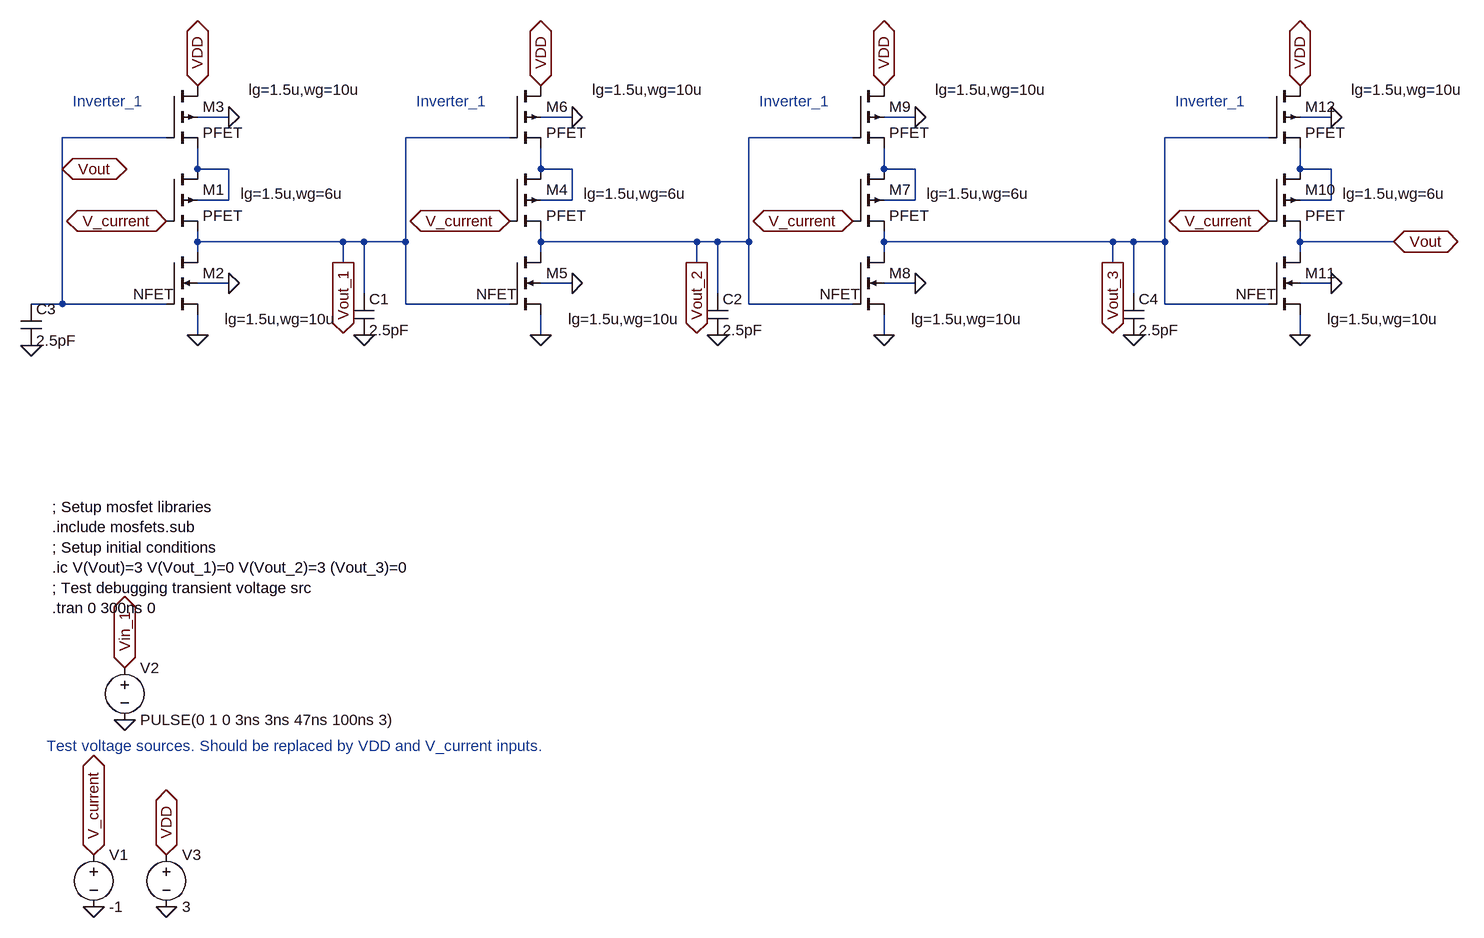
[diagram p0: schematic 2_oscillator_chencs_winterg_design_project.asc]
2_oscillator_chencs_winterg_design_project.asc, the LTspice schematic file:
Version 4
SHEET 1 1780 680
WIRE -128 -592 -176 -592
WIRE 400 -592 352 -592
WIRE 928 -592 880 -592
WIRE 1568 -592 1520 -592
WIRE -224 -560 -384 -560
WIRE 304 -560 144 -560
WIRE 832 -560 672 -560
WIRE 1472 -560 1312 -560
WIRE -384 -512 -384 -560
WIRE -176 -512 -176 -544
WIRE -128 -512 -176 -512
WIRE 352 -512 352 -544
WIRE 400 -512 352 -512
WIRE 880 -512 880 -544
WIRE 928 -512 880 -512
WIRE 1520 -512 1520 -544
WIRE 1568 -512 1520 -512
WIRE -128 -464 -128 -512
WIRE -128 -464 -176 -464
WIRE 400 -464 400 -512
WIRE 400 -464 352 -464
WIRE 928 -464 928 -512
WIRE 928 -464 880 -464
WIRE 1568 -464 1568 -512
WIRE 1568 -464 1520 -464
WIRE -176 -400 -176 -416
WIRE 48 -400 -176 -400
WIRE 80 -400 48 -400
WIRE 144 -400 144 -560
WIRE 144 -400 80 -400
WIRE 352 -400 352 -416
WIRE 592 -400 352 -400
WIRE 624 -400 592 -400
WIRE 672 -400 672 -560
WIRE 672 -400 624 -400
WIRE 880 -400 880 -416
WIRE 1232 -400 880 -400
WIRE 1264 -400 1232 -400
WIRE 1312 -400 1312 -560
WIRE 1312 -400 1264 -400
WIRE 1520 -400 1520 -416
WIRE 1664 -400 1520 -400
WIRE -176 -384 -176 -400
WIRE 352 -384 352 -400
WIRE 880 -384 880 -400
WIRE 1520 -384 1520 -400
WIRE 48 -368 48 -400
WIRE 592 -368 592 -400
WIRE 1232 -368 1232 -400
WIRE -128 -336 -176 -336
WIRE 400 -336 352 -336
WIRE 928 -336 880 -336
WIRE 1568 -336 1520 -336
WIRE 80 -320 80 -400
WIRE 624 -320 624 -400
WIRE 1264 -320 1264 -400
WIRE -384 -304 -384 -512
WIRE -384 -304 -432 -304
WIRE -224 -304 -384 -304
WIRE 144 -304 144 -400
WIRE 304 -304 144 -304
WIRE 672 -304 672 -400
WIRE 832 -304 672 -304
WIRE 1312 -304 1312 -400
WIRE 1472 -304 1312 -304
WIRE -176 -256 -176 -288
WIRE 352 -256 352 -288
WIRE 880 -256 880 -288
WIRE 1520 -256 1520 -288
FLAG -176 -256 0
FLAG -176 -640 VDD
IOPIN -176 -640 BiDir
FLAG -288 336 0
FLAG -288 256 Vin_1
IOPIN -288 256 BiDir
FLAG -128 -592 0
FLAG -224 -432 V_current
IOPIN -224 -432 BiDir
FLAG -384 -512 Vout
IOPIN -384 -512 BiDir
FLAG -128 -336 0
FLAG -336 624 0
FLAG -336 544 V_current
IOPIN -336 544 BiDir
FLAG -224 624 0
FLAG -224 544 VDD
IOPIN -224 544 BiDir
FLAG 352 -256 0
FLAG 352 -640 VDD
IOPIN 352 -640 BiDir
FLAG 400 -592 0
FLAG 304 -432 V_current
IOPIN 304 -432 BiDir
FLAG 400 -336 0
FLAG 880 -256 0
FLAG 880 -640 VDD
IOPIN 880 -640 BiDir
FLAG 928 -592 0
FLAG 832 -432 V_current
IOPIN 832 -432 BiDir
FLAG 928 -336 0
FLAG 80 -256 0
FLAG 624 -256 0
FLAG -432 -240 0
FLAG 48 -368 Vout_1
IOPIN 48 -368 Out
FLAG 592 -368 Vout_2
IOPIN 592 -368 Out
FLAG 1520 -256 0
FLAG 1520 -640 VDD
IOPIN 1520 -640 BiDir
FLAG 1568 -592 0
FLAG 1472 -432 V_current
IOPIN 1472 -432 BiDir
FLAG 1568 -336 0
FLAG 1664 -400 Vout
IOPIN 1664 -400 BiDir
FLAG 1264 -256 0
FLAG 1232 -368 Vout_3
IOPIN 1232 -368 Out
SYMBOL pmos4 -224 -512 R0
WINDOW 123 114 38 Left 2
SYMATTR Value2 lg=1.5u,wg=6u
SYMATTR InstName M1
SYMATTR Value PFET
SYMATTR Prefix X
SYMBOL nmos4 -224 -384 R0
WINDOW 123 90 103 Left 2
WINDOW 3 -51 65 Left 2
SYMATTR Value2 lg=1.5u,wg=10u
SYMATTR Value NFET
SYMATTR InstName M2
SYMATTR Prefix X
SYMBOL voltage -288 240 R0
SYMATTR InstName V2
SYMATTR Value PULSE(0 1 0 3ns 3ns 47ns 100ns 3)
SYMBOL pmos4 -224 -640 R0
WINDOW 123 127 6 Left 2
SYMATTR Value2 lg=1.5u,wg=10u
SYMATTR InstName M3
SYMATTR Value PFET
SYMATTR Prefix X
SYMBOL voltage -336 528 R0
SYMATTR InstName V1
SYMATTR Value -1
SYMBOL voltage -224 528 R0
SYMATTR InstName V3
SYMATTR Value 3
SYMBOL pmos4 304 -512 R0
WINDOW 123 114 38 Left 2
SYMATTR Value2 lg=1.5u,wg=6u
SYMATTR InstName M4
SYMATTR Value PFET
SYMATTR Prefix X
SYMBOL nmos4 304 -384 R0
WINDOW 123 90 103 Left 2
WINDOW 3 -51 65 Left 2
SYMATTR Value2 lg=1.5u,wg=10u
SYMATTR Value NFET
SYMATTR InstName M5
SYMATTR Prefix X
SYMBOL pmos4 304 -640 R0
WINDOW 123 127 6 Left 2
SYMATTR Value2 lg=1.5u,wg=10u
SYMATTR InstName M6
SYMATTR Value PFET
SYMATTR Prefix X
SYMBOL pmos4 832 -512 R0
WINDOW 123 114 38 Left 2
SYMATTR Value2 lg=1.5u,wg=6u
SYMATTR InstName M7
SYMATTR Value PFET
SYMATTR Prefix X
SYMBOL nmos4 832 -384 R0
WINDOW 123 90 103 Left 2
WINDOW 3 -51 65 Left 2
SYMATTR Value2 lg=1.5u,wg=10u
SYMATTR Value NFET
SYMATTR InstName M8
SYMATTR Prefix X
SYMBOL pmos4 832 -640 R0
WINDOW 123 127 6 Left 2
SYMATTR Value2 lg=1.5u,wg=10u
SYMATTR InstName M9
SYMATTR Value PFET
SYMATTR Prefix X
SYMBOL cap 64 -320 R0
SYMATTR InstName C1
SYMATTR Value 2.5pF
SYMATTR SpiceLine Rser=0.01
SYMBOL cap 608 -320 R0
SYMATTR InstName C2
SYMATTR Value 2.5pF
SYMATTR SpiceLine Rser=0.01
SYMBOL cap -448 -304 R0
SYMATTR InstName C3
SYMATTR Value 2.5pF
SYMATTR SpiceLine Rser=0.01
SYMBOL pmos4 1472 -512 R0
WINDOW 123 114 38 Left 2
SYMATTR Value2 lg=1.5u,wg=6u
SYMATTR InstName M10
SYMATTR Value PFET
SYMATTR Prefix X
SYMBOL nmos4 1472 -384 R0
WINDOW 123 90 103 Left 2
WINDOW 3 -51 65 Left 2
SYMATTR Value2 lg=1.5u,wg=10u
SYMATTR Value NFET
SYMATTR InstName M11
SYMATTR Prefix X
SYMBOL pmos4 1472 -640 R0
WINDOW 123 127 6 Left 2
SYMATTR Value2 lg=1.5u,wg=10u
SYMATTR InstName M12
SYMATTR Value PFET
SYMATTR Prefix X
SYMBOL cap 1248 -320 R0
SYMATTR InstName C4
SYMATTR Value 2.5pF
SYMATTR SpiceLine Rser=0.01
TEXT -400 8 Left 2 !; Setup mosfet libraries\n.include mosfets.sub\n; Setup initial conditions\n.ic V(Vout)=3 V(Vout_1)=0 V(Vout_2)=3 (Vout_3)=0\n; Test debugging transient voltage src\n.tran 0 300ns 0
TEXT -408 376 Left 2 ;Test voltage sources. Should be replaced by VDD and V_current inputs.
TEXT -368 -616 Left 2 ;Inverter_1
TEXT 160 -616 Left 2 ;Inverter_1
TEXT 688 -616 Left 2 ;Inverter_1
TEXT 1328 -616 Left 2 ;Inverter_1

The netlist it stands for:
* 2_oscillator_chencs_winterg_design_project.asc
XM1 N001 V_current Vout_1 N001 PFET lg=1.5u,wg=6u  ; pins D G S B
XM2 Vout_1 Vout 0 0 NFET lg=1.5u,wg=10u  ; pins D G S B
V2 Vin_1 0 PULSE(0 1 0 3ns 3ns 47ns 100ns 3)
XM3 VDD Vout N001 0 PFET lg=1.5u,wg=10u  ; pins D G S B
V1 V_current 0 -1
V3 VDD 0 3
XM4 N002 V_current Vout_2 N002 PFET lg=1.5u,wg=6u  ; pins D G S B
XM5 Vout_2 Vout_1 0 0 NFET lg=1.5u,wg=10u  ; pins D G S B
XM6 VDD Vout_1 N002 0 PFET lg=1.5u,wg=10u  ; pins D G S B
XM7 N003 V_current Vout_3 N003 PFET lg=1.5u,wg=6u  ; pins D G S B
XM8 Vout_3 Vout_2 0 0 NFET lg=1.5u,wg=10u  ; pins D G S B
XM9 VDD Vout_2 N003 0 PFET lg=1.5u,wg=10u  ; pins D G S B
C1 Vout_1 0 2.5pF Rser=0.01
C2 Vout_2 0 2.5pF Rser=0.01
C3 Vout 0 2.5pF Rser=0.01
XM10 N004 V_current Vout N004 PFET lg=1.5u,wg=6u  ; pins D G S B
XM11 Vout Vout_3 0 0 NFET lg=1.5u,wg=10u  ; pins D G S B
XM12 VDD Vout_3 N004 0 PFET lg=1.5u,wg=10u  ; pins D G S B
C4 Vout_3 0 2.5pF Rser=0.01
; Setup mosfet libraries
.include mosfets.sub
; Setup initial conditions
.ic V(Vout)=3 V(Vout_1)=0 V(Vout_2)=3 (Vout_3)=0
; Test debugging transient voltage src
.tran 0 300ns 0
* Test voltage sources. Should be replaced by VDD and V_current inputs.
* Inverter_1
* Inverter_1
* Inverter_1
* Inverter_1
.backanno
.end